# Altium project AC_controller.PrjPcb
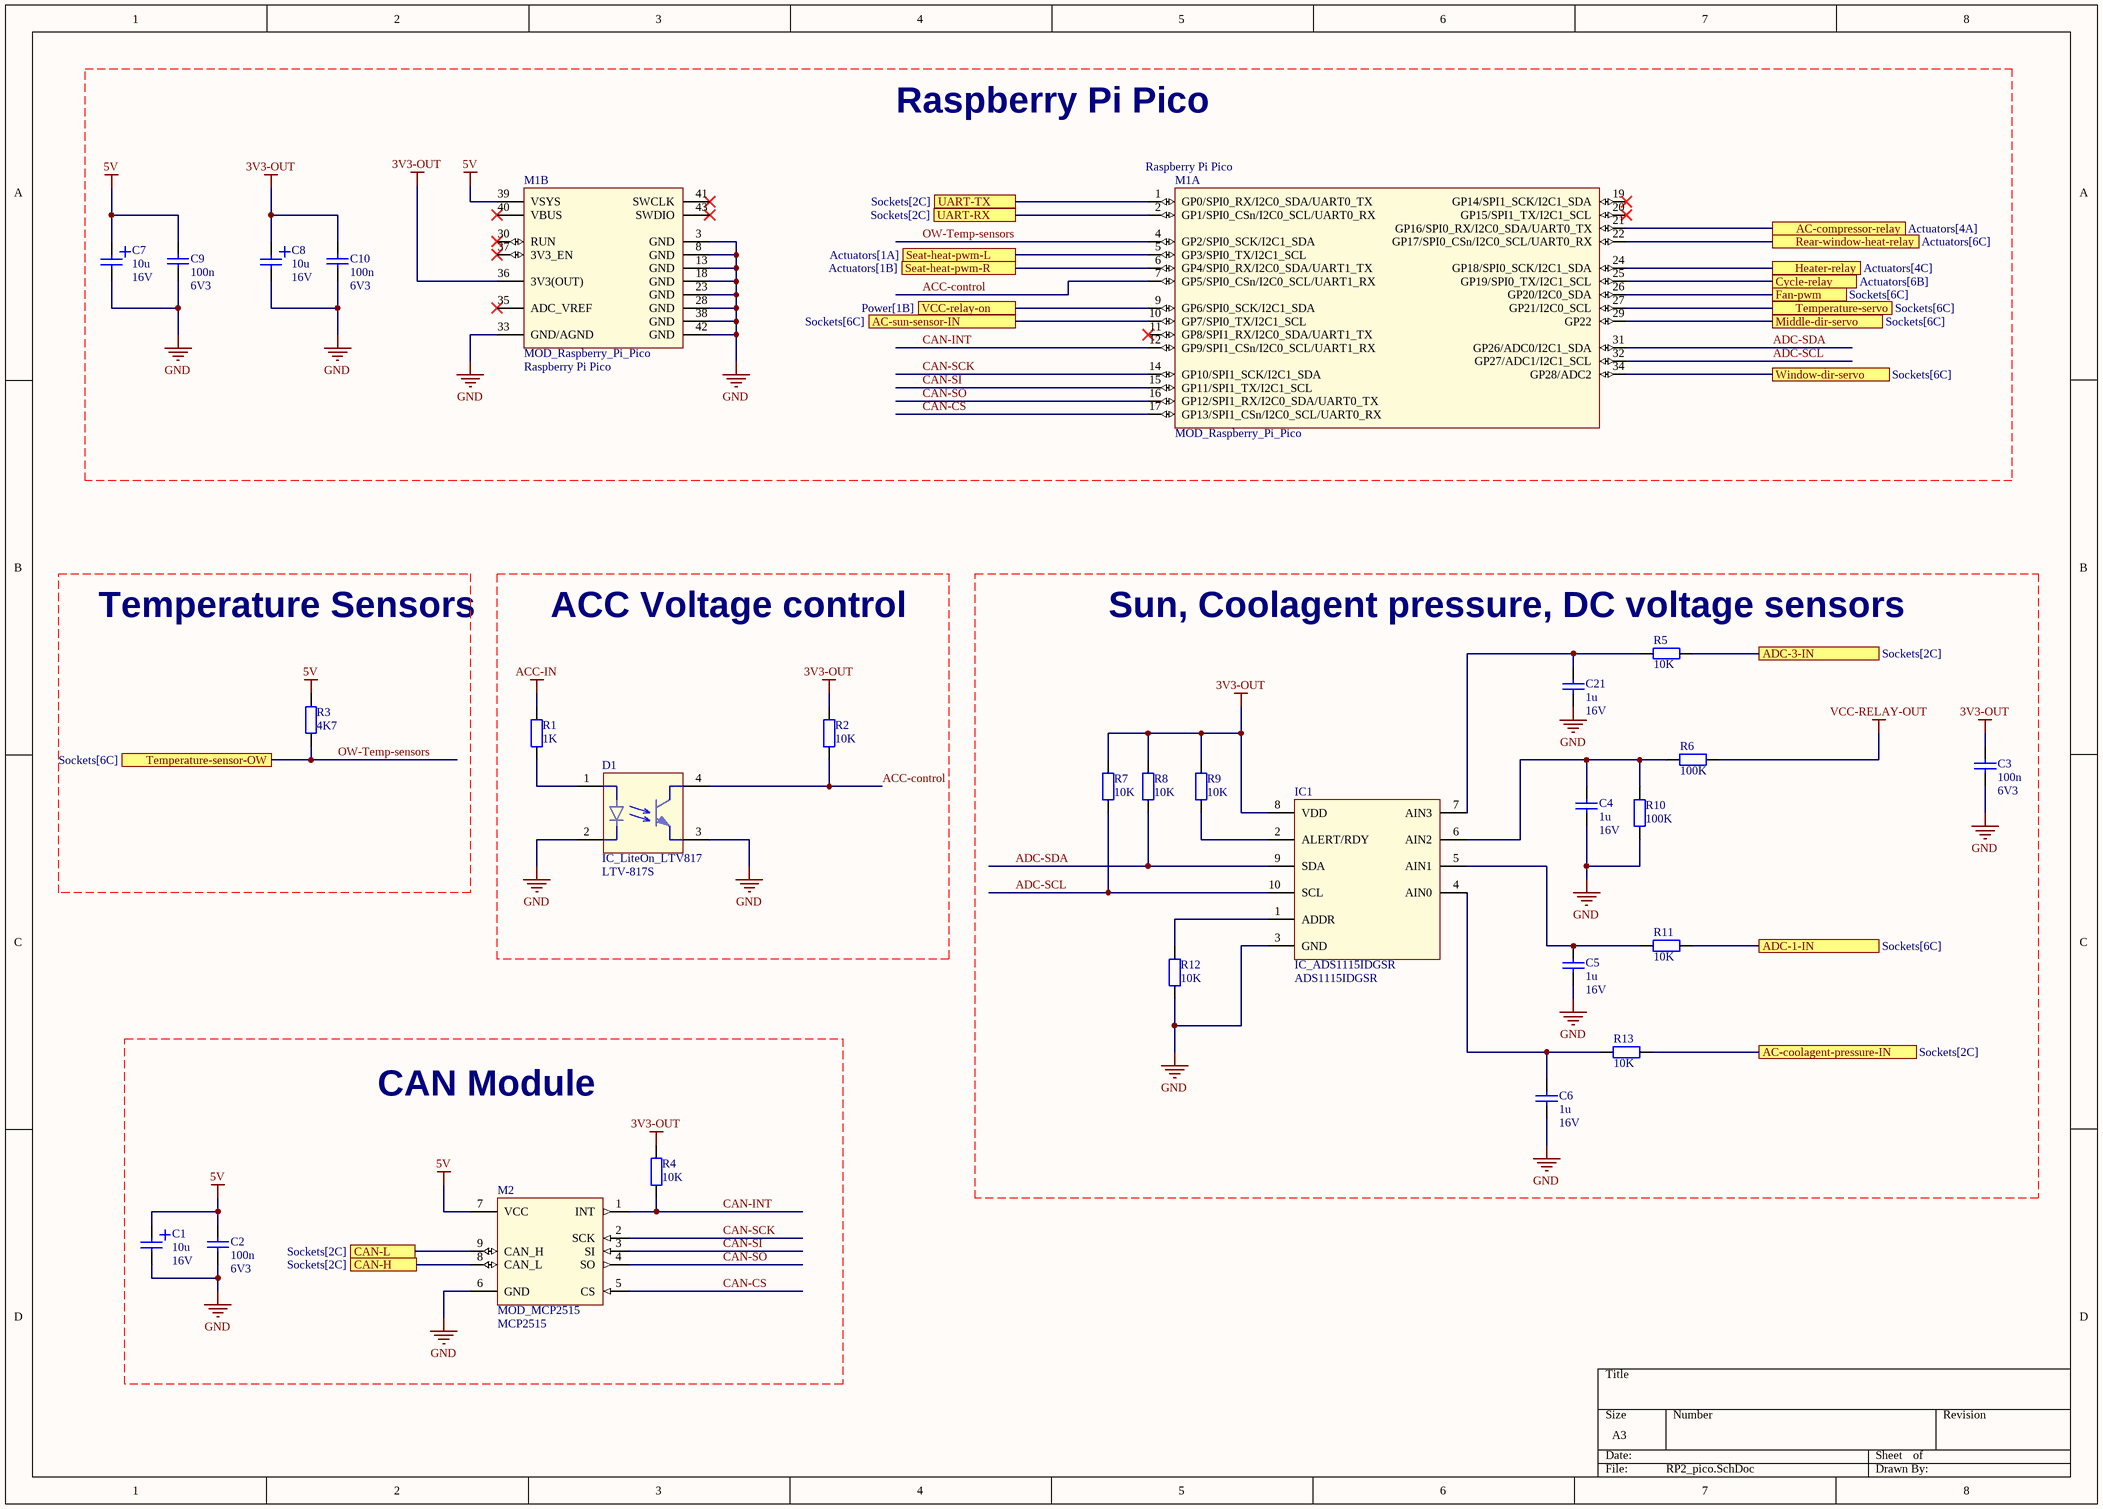
[diagram p0: RP2_pico.SchDoc]
4 sheets, 108 parts. Net scope: flat (ports and power ports of the same name join across sheets).
Board file: AC_controller_v1_1.PcbDoc
Sheets:
  RP2_pico.SchDoc
  Power.SchDoc
  Actuators.SchDoc
  Sockets.SchDoc

## Sheet RP2_pico.SchDoc
size A3; SheetNumber: 1; SheetTotal: 4

### Parts
C1  Value1: 10u  Value2: 16V  [CAPAE430X550N]  (hidden comment: CAP_POL)
C2  Value1: 100n  Value2: 6V3  [CAPC2012X88N]  (hidden comment: CAP)
C3  Value1: 100n  Value2: 6V3  [CAPC2012X88N]  (hidden comment: CAP)
C4  Value1: 1u  Value2: 16V  [CAPC2012X88N]  (hidden comment: CAP)
C5  Value1: 1u  Value2: 16V  [CAPC2012X88N]  (hidden comment: CAP)
C6  Value1: 1u  Value2: 16V  [CAPC2012X88N]  (hidden comment: CAP)
C7  Value1: 10u  Value2: 16V  [CAPAE430X550N]  (hidden comment: CAP_POL)
C8  Value1: 10u  Value2: 16V  [CAPAE430X550N]  (hidden comment: CAP_POL)
C9  Value1: 100n  Value2: 6V3  [CAPC2012X88N]  (hidden comment: CAP)
C10  Value1: 100n  Value2: 6V3  [CAPC2012X88N]  (hidden comment: CAP)
C21  Value1: 1u  Value2: 16V  [CAPC2012X88N]  (hidden comment: CAP)
D1  IC_LiteOn_LTV817  Value1: LTV-817S  [IC_LiteOn_ LTV-817S]
IC1  IC_ADS1115IDGSR  Value1: ADS1115IDGSR  [VSSOP-10]
M1  MOD_Raspberry_Pi_Pico  Value1: Raspberry Pi Pico  [MOD_Raspberry_Pi_Pico]  (parts A,B of 2)
M2  MOD_MCP2515  Value1: MCP2515  [MOD_MCP2515]
R1  Value1: 1K  [RESC2012X60N]  (hidden comment: RES)
R2  Value1: 10K  [RESC2012X60N]  (hidden comment: RES)
R3  Value1: 4K7  [RESC2012X60N]  (hidden comment: RES)
R4  Value1: 10K  [RESC2012X60N]  (hidden comment: RES)
R5  Value1: 10K  [RESC2012X60N]  (hidden comment: RES)
R6  Value1: 100K  [RESC2012X60N]  (hidden comment: RES)
R7  Value1: 10K  [RESC2012X60N]  (hidden comment: RES)
R8  Value1: 10K  [RESC2012X60N]  (hidden comment: RES)
R9  Value1: 10K  [RESC2012X60N]  (hidden comment: RES)
R10  Value1: 100K  [RESC2012X60N]  (hidden comment: RES)
R11  Value1: 10K  [RESC2012X60N]  (hidden comment: RES)
R12  Value1: 10K  [RESC2012X60N]  (hidden comment: RES)
R13  Value1: 10K  [RESC2012X60N]  (hidden comment: RES)

### Ports
AC-compressor-relay (see Actuators[4A]), AC-coolagent-pressure-IN (see Sockets[2C]), AC-sun-sensor-IN (see Sockets[6C]), ADC-1-IN (see Sockets[6C]), ADC-3-IN (see Sockets[2C]), CAN-H (see Sockets[2C]), CAN-L (see Sockets[2C]), Cycle-relay (see Actuators[6B]), Fan-pwm (see Sockets[6C]), Heater-relay (see Actuators[4C]), Middle-dir-servo (see Sockets[6C]), Rear-window-heat-relay (see Actuators[6C]), Seat-heat-pwm-L (see Actuators[1A]), Seat-heat-pwm-R (see Actuators[1B]), Temperature-sensor-OW (see Sockets[6C]), Temperature-servo (see Sockets[6C]), UART-RX (see Sockets[2C]), UART-TX (see Sockets[2C]), VCC-relay-on (see Power[1B]), Window-dir-servo (see Sockets[6C])

### Nets
3V3-OUT: C3.2 C8.1 C10.2 IC1.8(VDD) M1.36(3V3(OUT)) R2.2 R4.2 R7.2 R8.2 R9.2
5V: C1.1 C2.2 C7.1 C9.2 M1.39(VSYS) M2.7(VCC) R3.2
ACC-IN: R1.2
GND: C1.2 C2.1 C3.1 C4.1 C5.1 C6.1 C7.2 C8.2 C9.1 C10.1 C21.1 D1.2 D1.3 IC1.3(GND) M1.3(GND) M1.8(GND) M1.13(GND) M1.18(GND) M1.23(GND) M1.28(GND) M1.33(GND/AGND) M1.38(GND) M1.42(GND) M2.6(GND) R10.1 R12.1
VCC-RELAY-OUT: R6.2
ACC-control: D1.4 M1.7(GP5/SPI0_CSn/I2C0_SCL/UART1_RX) R2.1
ADC-SCL: IC1.10(SCL) M1.32(GP27/ADC1/I2C1_SCL) R7.1
ADC-SDA: IC1.9(SDA) M1.31(GP26/ADC0/I2C1_SDA) R8.1
CAN-CS: M1.17(GP13/SPI1_CSn/I2C0_SCL/UART0_RX) M2.5(CS)
CAN-INT: M1.12(GP9/SPI1_CSn/I2C0_SCL/UART1_RX) M2.1(INT) R4.1
CAN-SCK: M1.14(GP10/SPI1_SCK/I2C1_SDA) M2.2(SCK)
CAN-SI: M1.15(GP11/SPI1_TX/I2C1_SCL) M2.3(SI)
CAN-SO: M1.16(GP12/SPI1_RX/I2C0_SDA/UART0_TX) M2.4(SO)
OW-Temp-sensors: M1.4(GP2/SPI0_SCK/I2C1_SDA) R3.1 ; port Temperature-sensor-OW
NetC4_2: C4.2 IC1.6(AIN2) R6.1 R10.2
NetC5_2: C5.2 IC1.5(AIN1) R11.1
NetC6_2: C6.2 IC1.4(AIN0) R13.1
NetC21_2: C21.2 IC1.7(AIN3) R5.1
NetCN4_5: R13.2 ; port AC-coolagent-pressure-IN
NetCN4_6: R5.2 ; port ADC-3-IN
NetCN4_9: M2.8(CAN_L) ; port CAN-H
NetCN4_10: M2.9(CAN_H) ; port CAN-L
NetCN4_15: R11.2 ; port ADC-1-IN
NetD1_1: D1.1 R1.1
NetIC1_1: IC1.1(ADDR) R12.2
NetIC1_2: IC1.2(ALERT/RDY) R9.1
NetM1_1: M1.1(GP0/SPI0_RX/I2C0_SDA/UART0_TX) ; port UART-TX
NetM1_2: M1.2(GP1/SPI0_CSn/I2C0_SCL/UART0_RX) ; port UART-RX
NetM1_5: M1.5(GP3/SPI0_TX/I2C1_SCL) ; port Seat-heat-pwm-L
NetM1_6: M1.6(GP4/SPI0_RX/I2C0_SDA/UART1_TX) ; port Seat-heat-pwm-R
NetM1_9: M1.9(GP6/SPI0_SCK/I2C1_SDA) ; port VCC-relay-on
NetM1_10: M1.10(GP7/SPI0_TX/I2C1_SCL) ; port AC-sun-sensor-IN
NetM1_21: M1.21(GP16/SPI0_RX/I2C0_SDA/UART0_TX) ; port AC-compressor-relay
NetM1_22: M1.22(GP17/SPI0_CSn/I2C0_SCL/UART0_RX) ; port Rear-window-heat-relay
NetM1_24: M1.24(GP18/SPI0_SCK/I2C1_SDA) ; port Heater-relay
NetM1_25: M1.25(GP19/SPI0_TX/I2C1_SCL) ; port Cycle-relay
NetM1_26: M1.26(GP20/I2C0_SDA) ; port Fan-pwm
NetM1_27: M1.27(GP21/I2C0_SCL) ; port Temperature-servo
NetM1_29: M1.29(GP22) ; port Middle-dir-servo
NetM1_34: M1.34(GP28/ADC2) ; port Window-dir-servo

Not connected (* = marked no-connect by the designer): M1 11(GP8/SPI1_RX/I2C0_SDA/UART1_TX)* 19(GP14/SPI1_SCK/I2C1_SDA)* 20(GP15/SPI1_TX/I2C1_SCL)* 30(RUN)* 35(ADC_VREF)* 37(3V3_EN)* 40(VBUS)* 41(SWCLK)* 43(SWDIO)*

### Notes on the sheet
- Raspberry Pi Pico
- Temperature Sensors
- ACC Voltage control
- (near R5) Sun, Coolagent pressure, DC voltage sensors
- CAN Module

### Library data of the parts
C1 C7 C8 = 01_01399: ELCO 20%; Manufacturer: Nichicon; Manufacturer PN: UWF1C100MCL1GB; AutoId: 1399; DeviceType: capacitor; SubType: Electrolyte; Id: 01_01399; Status: 2 - Checked and Approved; MountType: SMT; ComponentLink1URL: X:\01_Datasheets\CAP_NICHICON_UWF1C100MCL1GB.pdf; Supplier 1: Farnell; Supplier Part Number 1: 647-UWF1C100MCL1GB; ComponentLink1Description: Datasheet
C2 C3 C9 C10 = 01_00637: X7R 10% 0805; Manufacturer: KEMET; Manufacturer PN: C0805C104K9RACTU; AutoId: 637; DeviceType: capacitor; SubType: Ceramic; Id: 01_00637; Status: 2 - Checked and Approved; MountType: SMT; ComponentLink1URL: X:\01_Datasheets\CAP_KEMET_CxxxxCxxxXxRAC.pdf; Supplier 1: Farnell; Supplier Part Number 1: 80-C0805C104K9R; ComponentLink1Description: Datasheet
C4-C6 C21 = 01_11496: Manufacturer: Hitano; Manufacturer PN: 0805B105K160N3; AutoId: 1562; Value3: X7R; DeviceType: capacitor; SubType: Ceramic; Id: 01_11496; Status: 0 - Unchecked; MountType: SMT; ComponentLink1URL: X:\01_Datasheets\; Supplier 1: Farnell; ComponentLink1Description: Datasheet
D1 = 07_00275: Transistor Output Optocouplers Optocoupler Phototrans; Manufacturer: Lite-On; AutoId: 276; Id: 07_00275; Value2: Optocouplers; Value3: Optocouplers; Manufacturer PN: LTV-817S; DeviceType: Optocouple; Status: 0 - Unchecked; MountType: SMT; ComponentLink1Description: Datasheet; ComponentLink1URL: X:\01_Datasheets\IC_Lite_On_LTV-817S.pdf; ComponentLink2Description: ComponentVerificationSheet; ComponentLink2URL: X:\02_ComponentVerificationSheets\; Supplier 1: Mouser; Supplier Part Number 1: 859-LTV-817S
IC1 = 07_00293: Analog to Digital Converters - ADC 16B ADC w/ Int MUX PGA Comp Osc & Ref; Manufacturer: Texas Instruments; AutoId: 300; Value2: 10 pin I2C ADC; DeviceType: IC; Id: 07_00293; Manufacturer PN: ADS1115IDGSR; Status: 0 - Unchecked; MountType: SMT; ComponentLink1Description: Datasheet; ComponentLink1URL: X:\01_Datasheets\ads1115.pdf; ComponentLink2Description: ComponentVerificationSheet; ComponentLink2URL: X:\02_ComponentVerificationSheets\
M1 = 12_00158: Single Board Computers Raspberry Pi Pico; Manufacturer PN: SC0915; AutoId: 169; Value2: RP2040; Value3: ARM Cortex M0; DeviceType: misc; Id: 12_00158; Manufacturer: Raspberry Pi; MountType: SMT; ComponentLink1Description: Datasheet; ComponentLink1URL: X:\01_Datasheets\Raspberry_Pi_Pico.pdf; ComponentLink2Description: ComponentVerificationSheet; ComponentLink2URL: X:\02_ComponentVerificationSheets\; Supplier 1: Mouser; Supplier Part Number 1: 358-SC0915
M2 = 12_00161: CAN bus  module; Manufacturer: CH; AutoId: 172; DeviceType: misc; Id: 12_00161; Value2: Module; Status: 0 - Unchecked; MountType: THD; ComponentLink1Description: Datasheet; ComponentLink1URL: X:\01_Datasheets\; ComponentLink2Description: ComponentVerificationSheet; ComponentLink2URL: X:\02_ComponentVerificationSheets\; Supplier 1: Arduino.ua
R1 = 15_00329: RESISTOR, 0805, 1K, 1%, SMD; Manufacturer: Yageo; Manufacturer PN: RC0805FR-071K; Id: 15_00341; AutoId: 329; Value2: 0W125; SubType: Metal film; DeviceType: resistor; Status: 2 - Checked and Approved; MountType: SMT; ComponentLink1Description: Datasheet; ComponentLink1URL: X:\01_Datasheets\RES_YAGEO_RC0805FR.pdf; Supplier 1: Farnell; Supplier Part Number 1: 9237496
R2 R4 R7-R9 R11-R13 = 15_00341: RESISTOR, 0805, 10K, 1%, SMD; Manufacturer: Yageo; Manufacturer PN: RC0805FR-0710K; AutoId: 341; Value2: 0W125; SubType: Metal film; Id: 15_00341; DeviceType: resistor; Status: 0 - Unchecked; MountType: SMT; ComponentLink1Description: Datasheet; ComponentLink1URL: X:\01_Datasheets\RES_YAGEO_RC0805FR.pdf; Supplier 1: Farnell
R3 = 15_00337: RESISTOR, 0805, 4K7, 1%, SMD; Manufacturer: Yageo; Manufacturer PN: RC0805FR-074K7; AutoId: 337; Value2: 0W125; SubType: Metal film; Id: 15_00337; DeviceType: resistor; Status: 2 - Checked and Approved; MountType: SMT; ComponentLink1Description: Datasheet; ComponentLink1URL: X:\01_Datasheets\RES_YAGEO_RC0805FR.pdf; Supplier 1: Farnell; Supplier Part Number 1: 9237704
R5 R6 R10 = 15_00353: RESISTOR, 0805, 100K, 1%, SMD; Manufacturer: Yageo; Manufacturer PN: RC0805FR-07100K; AutoId: 353; Value2: 0W125; SubType: Metal film; Id: 15_00353; DeviceType: resistor; Status: 0 - Unchecked; MountType: SMT; ComponentLink1Description: Datasheet; ComponentLink1URL: X:\01_Datasheets\RES_YAGEO_RC0805FR.pdf; Supplier 1: Farnell

## Sheet Power.SchDoc
size A3; SheetNumber: 2; SheetTotal: 4
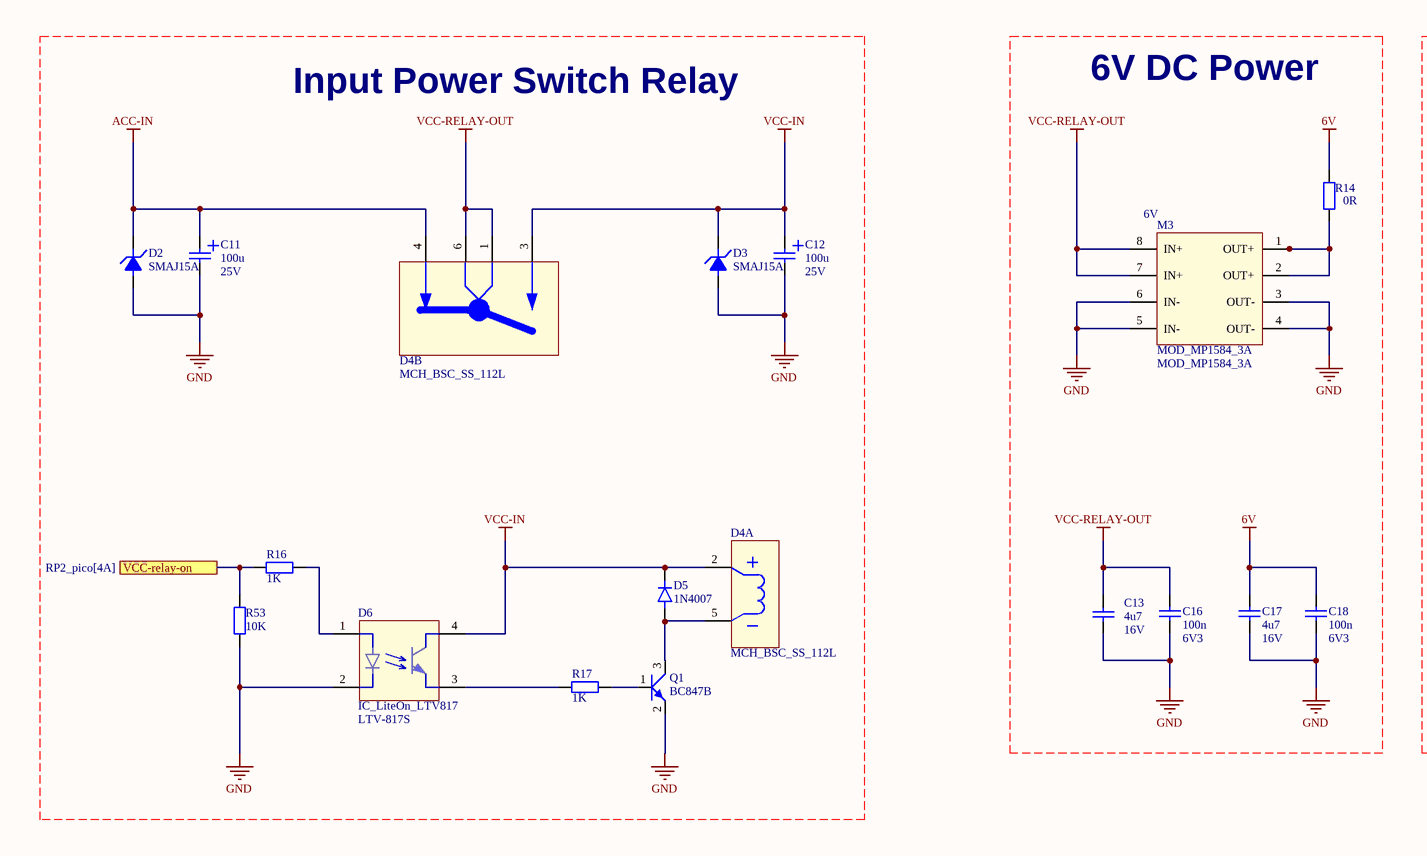
[diagram p1: Power.SchDoc, left]
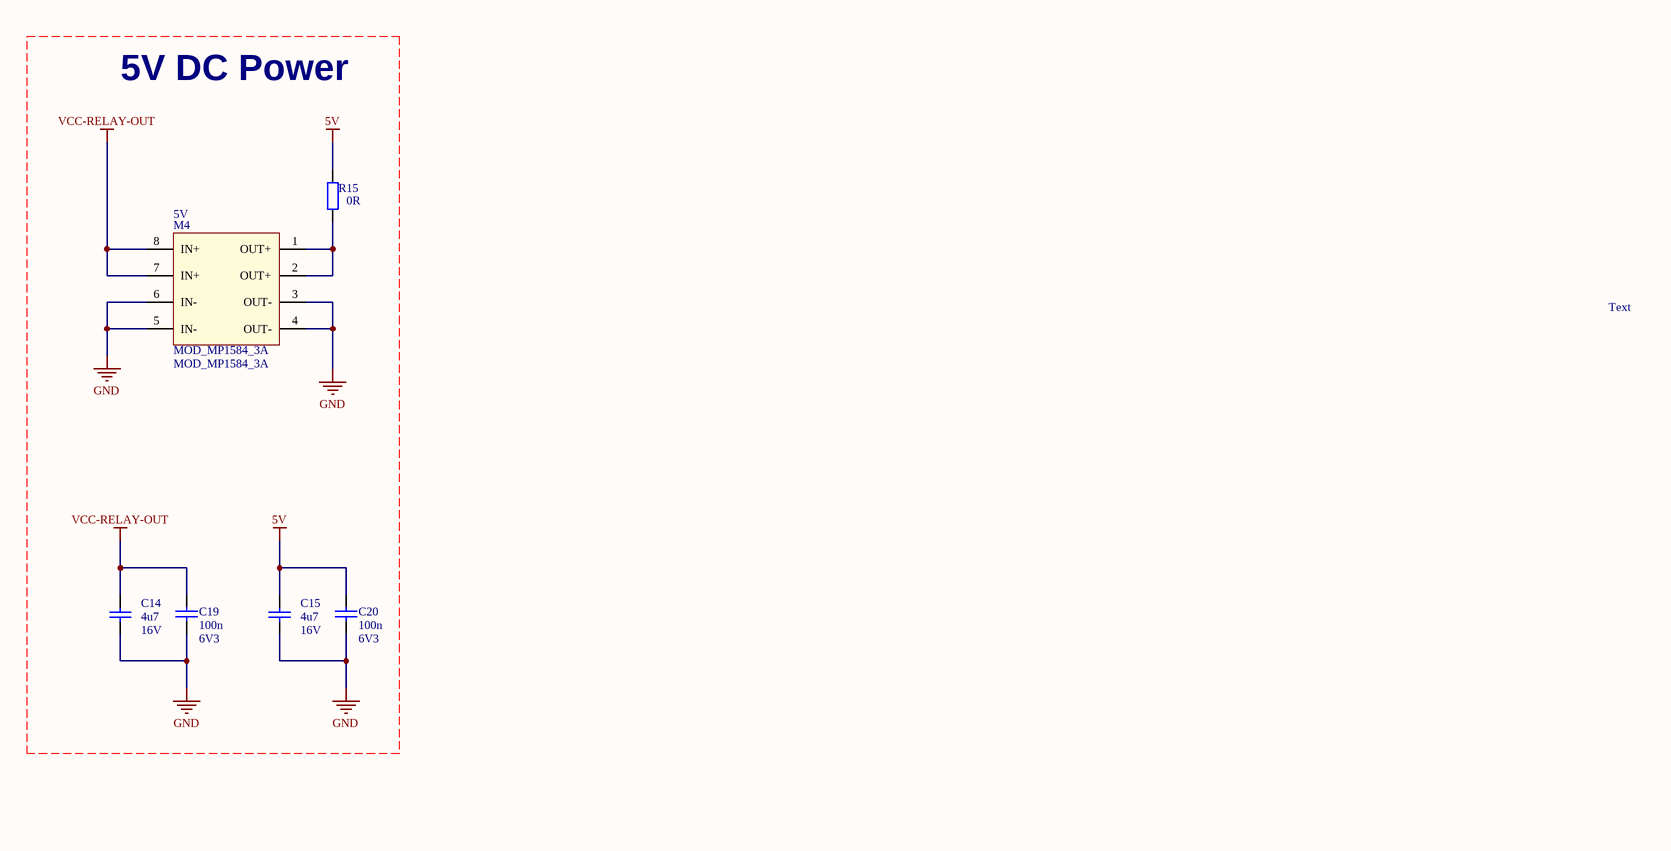
[diagram p2: Power.SchDoc, right]

### Parts
C11  Value1: 100u  Value2: 25V  [CAPAE9983X102N]  (hidden comment: CAP_POL)
C12  Value1: 100u  Value2: 25V  [CAPAE9983X102N]  (hidden comment: CAP_POL)
C13  Value1: 4u7  Value2: 16V  [CAPC2012X140N]  (hidden comment: CAP)
C14  Value1: 4u7  Value2: 16V  [CAPC2012X140N]  (hidden comment: CAP)
C15  Value1: 4u7  Value2: 16V  [CAPC2012X140N]  (hidden comment: CAP)
C16  Value1: 100n  Value2: 6V3  [CAPC2012X88N]  (hidden comment: CAP)
C17  Value1: 4u7  Value2: 16V  [CAPC2012X140N]  (hidden comment: CAP)
C18  Value1: 100n  Value2: 6V3  [CAPC2012X88N]  (hidden comment: CAP)
C19  Value1: 100n  Value2: 6V3  [CAPC2012X88N]  (hidden comment: CAP)
C20  Value1: 100n  Value2: 6V3  [CAPC2012X88N]  (hidden comment: CAP)
D2  Value1: SMAJ15A  [DO-214AC]  (hidden comment: DIO_UNIDIRECTIONAL_TVS)
D3  Value1: SMAJ15A  [DO-214AC]  (hidden comment: DIO_UNIDIRECTIONAL_TVS)
D4  MCH_BSC_SS_112L  [MCH_BSC_SS_112L]  (parts A,B of 2)
D5  Value1: 1N4007  [DO-214AC]  (hidden comment: DIO)
D6  IC_LiteOn_LTV817  Value1: LTV-817S  [IC_LiteOn_ LTV-817S]
M3  MOD_MP1584_3A  [MOD_MP1584_3A]
M4  MOD_MP1584_3A  [MOD_MP1584_3A]
Q1  Value1: BC847B  [SOT23]  (hidden comment: TRS_NPN_123)
R14  Value1: 0R  [RESC2012X60N]  (hidden comment: RES)
R15  Value1: 0R  [RESC2012X60N]  (hidden comment: RES)
R16  Value1: 1K  [RESC2012X60N]  (hidden comment: RES)
R17  Value1: 1K  [RESC2012X60N]  (hidden comment: RES)
R53  Value1: 10K  [RESC2012X60N]  (hidden comment: RES)

### Ports
VCC-relay-on (see RP2_pico[4A])

### Nets
5V: C15.1 C20.2 R15.2
6V: C17.2 C18.2 R14.2
ACC-IN: C11.1 D2.2 D4.4
GND: C11.2 C12.2 C13.2 C14.2 C15.2 C16.1 C17.1 C18.1 C19.1 C20.1 D2.1 D3.1 D6.2 M3.3(OUT-) M3.4(OUT-) M3.5(IN-) M3.6(IN-) M4.3(OUT-) M4.4(OUT-) M4.5(IN-) M4.6(IN-) Q1.2(E) R53.2
VCC-IN: C12.1 D3.2 D4.2 D4.3 D5.2(K) D6.4
VCC-RELAY-OUT: C13.1 C14.1 C16.2 C19.2 D4.1 D4.6 M3.7(IN+) M3.8(IN+) M4.7(IN+) M4.8(IN+)
NetD4_5: D4.5 D5.1(A) Q1.3(C)
NetD6_1: D6.1 R16.1
NetD6_3: D6.3 R17.2
NetM1_9: R16.2 R53.1 ; port VCC-relay-on
NetM3_1: M3.1(OUT+) M3.2(OUT+) R14.1
NetM4_1: M4.1(OUT+) M4.2(OUT+) R15.1
NetQ1_1: Q1.1(B) R17.1

### Notes on the sheet
- Input Power Switch Relay
- 6V DC Power
- 5V DC Power
- (near M3) 6V
- (near M4) 5V
- Text

### Library data of the parts
C11 C12 = 01_01471: PANASONIC - EEEFC1E101AP - CAP, ALU ELEC, 100UF, 25V, SMD, REEL; AutoId: 1471; DeviceType: capacitor; SubType: Electrolyte; Id: 01_01471; Manufacturer: Panasonic; Manufacturer PN: EEEFC1E101AP; Status: 0 - Unchecked; MountType: SMD; ComponentLink1URL: X:\01_dataSheets\CAP_PANASONIC_EEUFCXXXXXX.pdf; Supplier 1: Farnell; Supplier Part Number 1: 2254349; ComponentLink1Description: Datasheet
C13-C15 C17 = 01_01402: X7R 10% 0805; Manufacturer: MURATA; Manufacturer PN: GRM21BR71C475KA73L; AutoId: 1402; DeviceType: capacitor; SubType: Ceramic; Id: 01_01402; Status: 2 - Checked and Approved; MountType: SMD; ComponentLink1URL: X:\01_DataSheets\CAP_MURATA_GRM.pdf; Supplier 1: Farnell; Supplier Part Number 1: 1797015; ComponentLink1Description: Datasheet
C16 C18-C20 = 01_00637: as C2 on sheet RP2_pico; Id: 01_00637; Status: 2 - Checked and Approved; MountType: SMT; ComponentLink1URL: X:\01_Datasheets\CAP_KEMET_CxxxxCxxxXxRAC.pdf; Supplier 1: Farnell; Supplier Part Number 1: 80-C0805C104K9R; ComponentLink1Description: Datasheet
D2 D3 = 03_00100: Transient Voltage Suppressors; Manufacturer: Littelfuse; AutoId: 118; Value2: 15Vr 400W 16.4A; Value3: TVS; DeviceType: diode; Id: 03_00100; Manufacturer PN: SMAJ15A; Status: 0 - Unchecked; MountType: SMD; ComponentLink1Description: Datasheet; ComponentLink1URL: X:\01_Datasheets\DIO_Littelfuse_SMAJ58A.pdf; ComponentLink2Description: ComponentVerificationSheet; ComponentLink2URL: X:\02_ComponentVerificationSheets\; Supplier Part Number 1: SMAJ15A
D4 = 09_0010: Small relay 6 pins 12V, 2A; Manufacturer: KJS; AutoId: 10; Id: 09_0010; Value1: n/a; Value2: n/a; ComponentLink1Description: Datasheet; ComponentLink1URL: X:\01_Datasheets\MCH_BSC_SS_112L.pdf; ComponentLink2Description: ComponentVerificationSheet; ComponentLink2URL: X:\02_ComponentVerificationSheets\
D5 = 03_00099: M7 Diode, max 30A; AutoId: 117; Value2: 1A, 400V; Id: 03_00099; Value3: M7; Manufacturer PN: 1N4007; DeviceType: diode; ComponentLink1Description: Datasheet; ComponentLink1URL: X:\01_Datasheets\; ComponentLink2Description: ComponentVerificationSheet; ComponentLink2URL: X:\02_ComponentVerificationSheets\
D6 = 07_00275: as D1 on sheet RP2_pico; Id: 07_00275; Value2: Optocouplers; Value3: Optocouplers; Manufacturer PN: LTV-817S; DeviceType: Optocouple; Status: 0 - Unchecked; MountType: SMT; ComponentLink1Description: Datasheet; ComponentLink1URL: X:\01_Datasheets\IC_Lite_On_LTV-817S.pdf; ComponentLink2Description: ComponentVerificationSheet; ComponentLink2URL: X:\02_ComponentVerificationSheets\; Supplier 1: Mouser; Supplier Part Number 1: 859-LTV-817S
M3 M4 = 12_00162: DC-DC converter 3A; Manufacturer: CH; AutoId: 173; Value2: Module; DeviceType: misc; Id: 12_00162; Value1: MOD_MP1584_3A; Status: 0 - Unchecked; MountType: THD; ComponentLink1Description: Datasheet; ComponentLink1URL: X:\01_Datasheets\; ComponentLink2Description: ComponentVerificationSheet; ComponentLink2URL: X:\02_ComponentVerificationSheets\; Supplier 1: Arduino.ua
Q1 = 19_00039: Bipolar Transistors - BJT NPN 45V 100mA; Manufacturer: NXP; Manufacturer PN: BC847B,215; AutoId: 39; Value2: 45V 0,1A; Id: 19_00039; DeviceType: transistor; SubType: NPN; Status: 0 - Unchecked; MountType: SMD; ComponentLink1Description: Datasheet; ComponentLink1URL: X:\01_Datasheets\TRS_NXP_BC847.pdf; ComponentLink2Description: ComponentVerificationSheet; ComponentLink2URL: X:\02_ComponentVerificationSheets\; Supplier 1: Mouser; Supplier Part Number 1: 771-BC847B-T/R
R14 R15 = 15_00632: Thick Film Resistors - SMD ZERO OHM JUMPER 1/8watt; Manufacturer: Vishay; Manufacturer PN: RCG08050000Z0EA`; AutoId: 632; Value2: 125mW; Id: 15_00632; Footprint4: n/a; DeviceType: resistor; Status: 0 - Unchecked; MountType: SMT; ComponentLink1Description: Datasheet; ComponentLink1URL: X:\01_Datasheets\; Supplier 1: Mouser; Supplier Part Number 1: 71-RCG08050000Z0EA
R16 R17 = 15_00329: RESISTOR, 0805, 1K, 1%, SMD; Manufacturer: Yageo; Manufacturer PN: RC0805FR-071K; AutoId: 329; Value2: 0W125; SubType: Metal film; Id: 15_00329; DeviceType: resistor; Status: 2 - Checked and Approved; MountType: SMT; ComponentLink1Description: Datasheet; ComponentLink1URL: X:\01_Datasheets\RES_YAGEO_RC0805FR.pdf; Supplier 1: Farnell; Supplier Part Number 1: 9237496
R53 = 15_00341: as R2 on sheet RP2_pico; Id: 15_00341; DeviceType: resistor; Status: 0 - Unchecked; MountType: SMT; ComponentLink1Description: Datasheet; ComponentLink1URL: X:\01_Datasheets\RES_YAGEO_RC0805FR.pdf; Supplier 1: Farnell

## Sheet Actuators.SchDoc
size A2; SheetNumber: 3; SheetTotal: 4
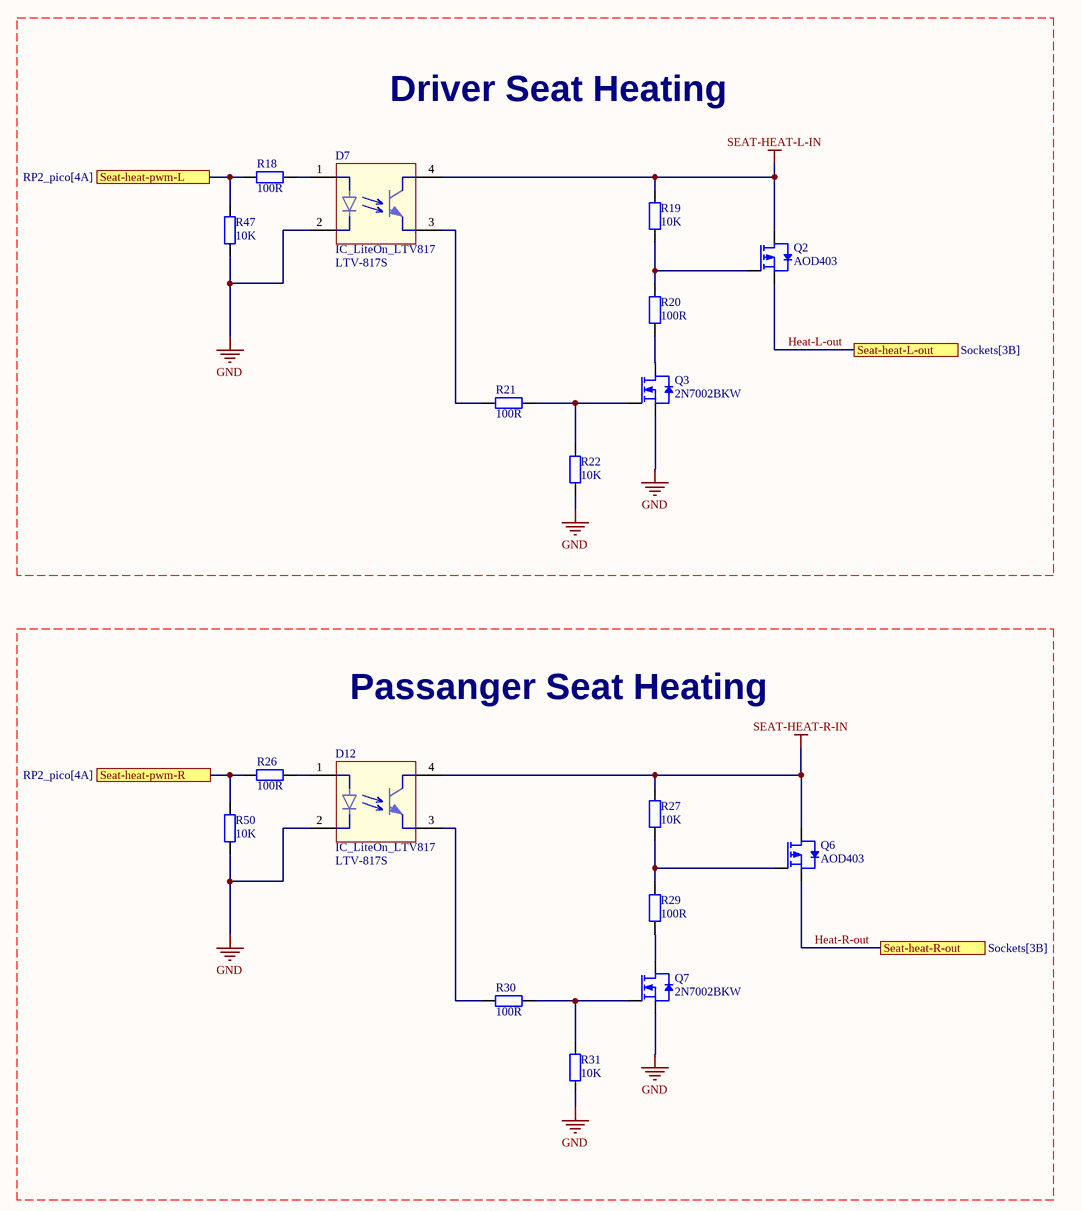
[diagram p3: Actuators.SchDoc, left]
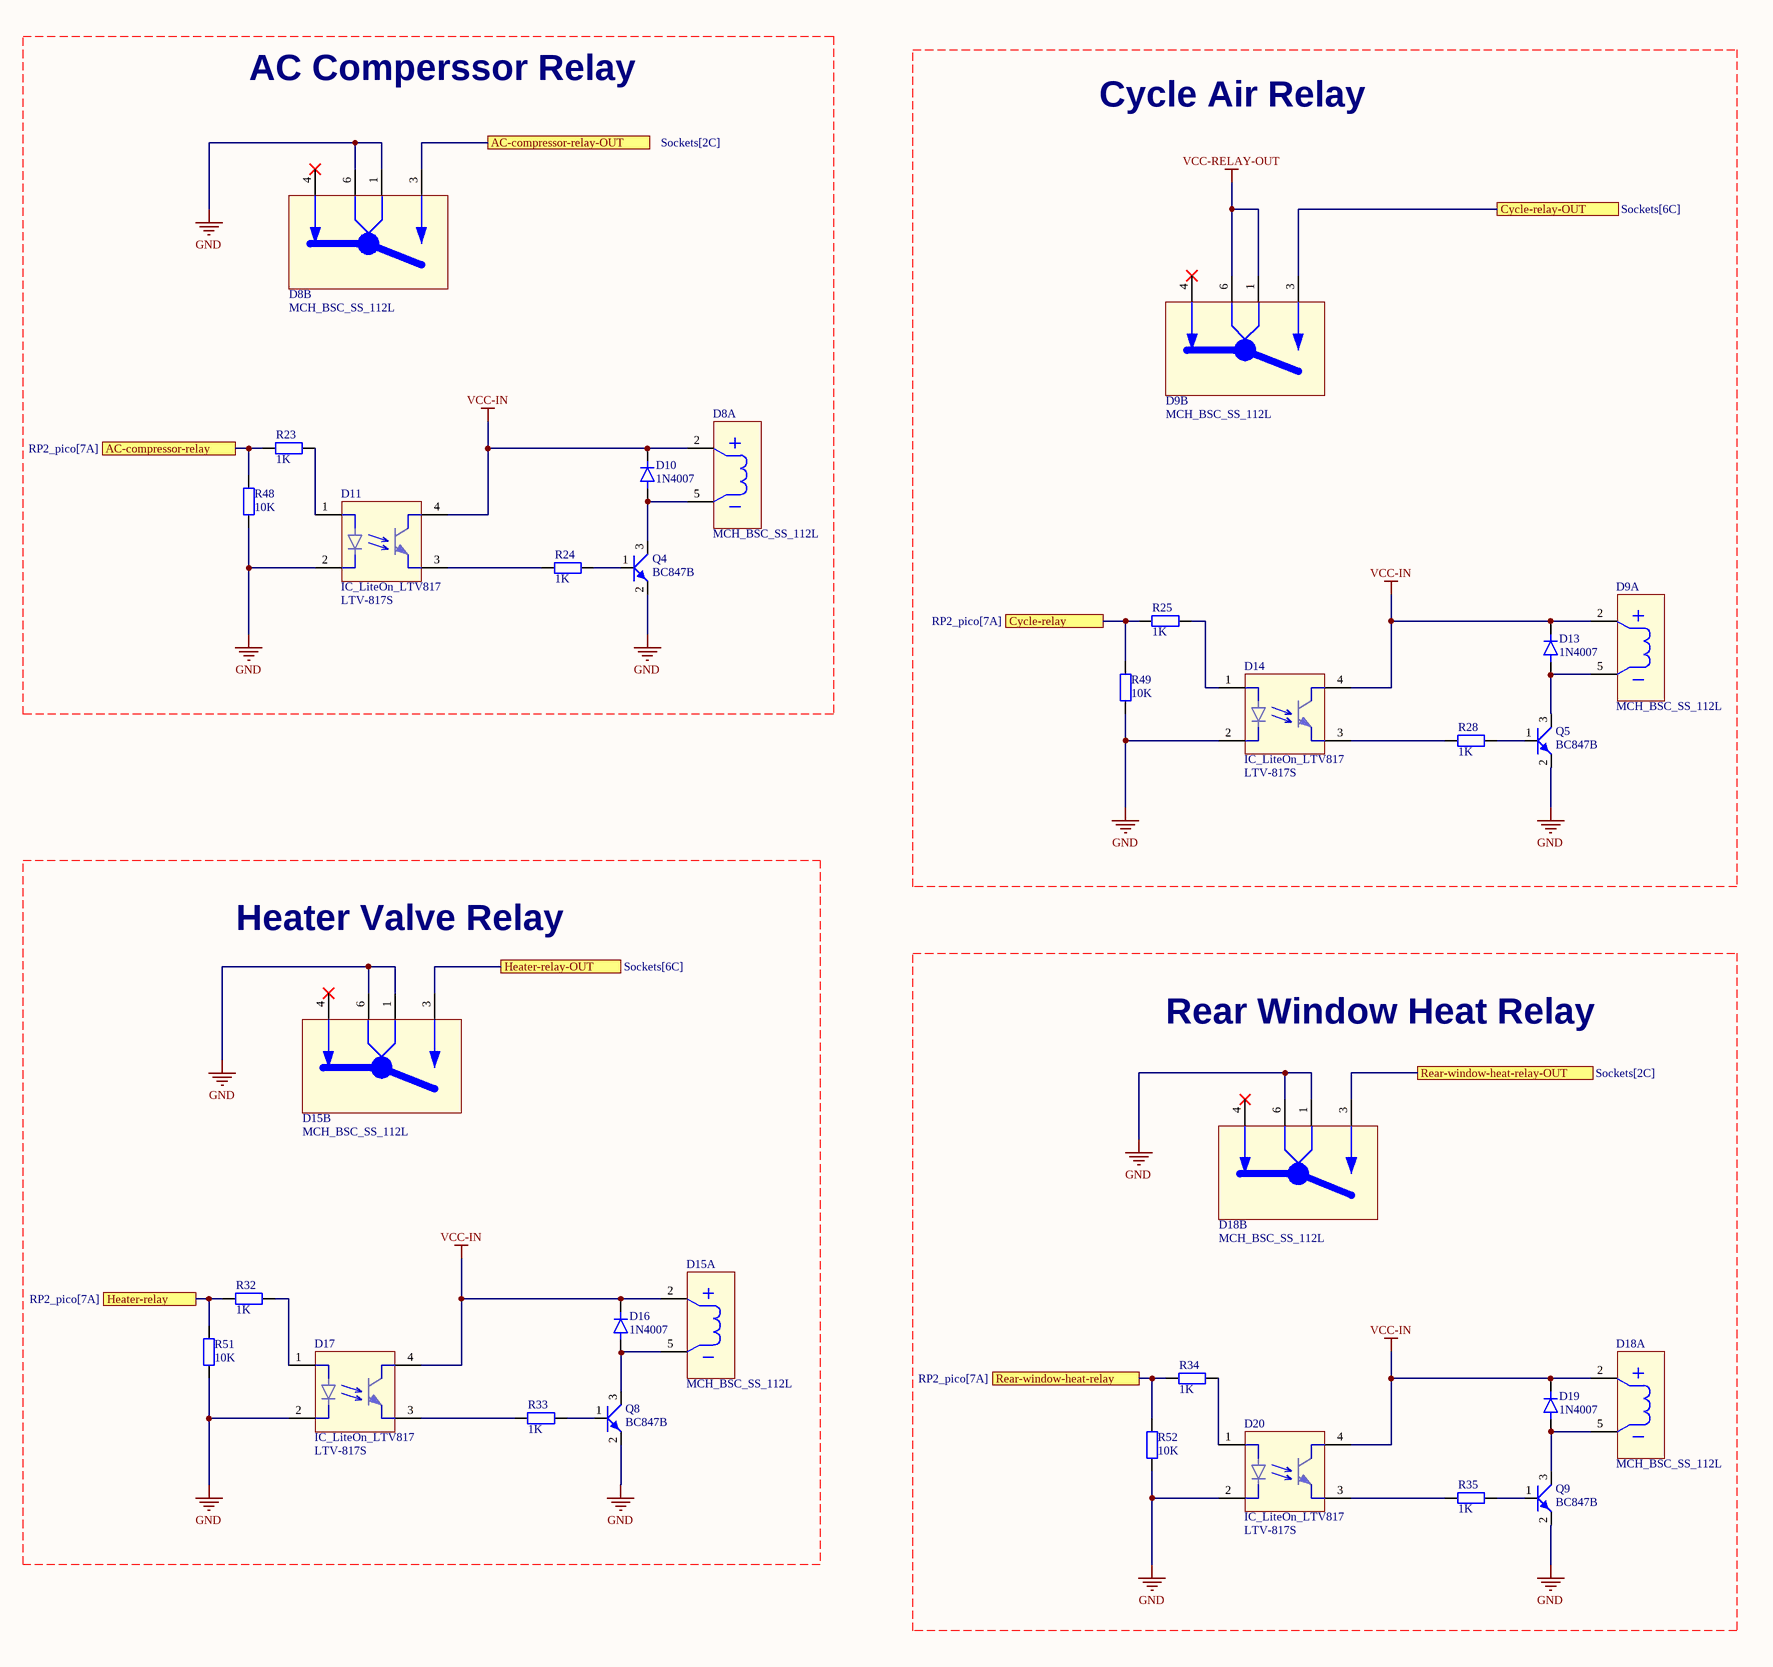
[diagram p4: Actuators.SchDoc, right]

### Parts
D7  IC_LiteOn_LTV817  Value1: LTV-817S  [IC_LiteOn_ LTV-817S]
D8  MCH_BSC_SS_112L  [MCH_BSC_SS_112L]  (parts A,B of 2)
D9  MCH_BSC_SS_112L  [MCH_BSC_SS_112L]  (parts A,B of 2)
D10  Value1: 1N4007  [DO-214AC]  (hidden comment: DIO)
D11  IC_LiteOn_LTV817  Value1: LTV-817S  [IC_LiteOn_ LTV-817S]
D12  IC_LiteOn_LTV817  Value1: LTV-817S  [IC_LiteOn_ LTV-817S]
D13  Value1: 1N4007  [DO-214AC]  (hidden comment: DIO)
D14  IC_LiteOn_LTV817  Value1: LTV-817S  [IC_LiteOn_ LTV-817S]
D15  MCH_BSC_SS_112L  [MCH_BSC_SS_112L]  (parts A,B of 2)
D16  Value1: 1N4007  [DO-214AC]  (hidden comment: DIO)
D17  IC_LiteOn_LTV817  Value1: LTV-817S  [IC_LiteOn_ LTV-817S]
D18  MCH_BSC_SS_112L  [MCH_BSC_SS_112L]  (parts A,B of 2)
D19  Value1: 1N4007  [DO-214AC]  (hidden comment: DIO)
D20  IC_LiteOn_LTV817  Value1: LTV-817S  [IC_LiteOn_ LTV-817S]
Q2  Value1: AOD403  [TO-252]  (hidden comment: TRS_FETP_123)
Q3  Value1: 2N7002BKW  [SOT65P210X110-3N]  (hidden comment: TRS_FETN_123)
Q4  Value1: BC847B  [SOT23]  (hidden comment: TRS_NPN_123)
Q5  Value1: BC847B  [SOT23]  (hidden comment: TRS_NPN_123)
Q6  Value1: AOD403  [TO-252]  (hidden comment: TRS_FETP_123)
Q7  Value1: 2N7002BKW  [SOT65P210X110-3N]  (hidden comment: TRS_FETN_123)
Q8  Value1: BC847B  [SOT23]  (hidden comment: TRS_NPN_123)
Q9  Value1: BC847B  [SOT23]  (hidden comment: TRS_NPN_123)
R18  Value1: 100R  [RESC2012X60N]  (hidden comment: RES)
R19  Value1: 10K  [RESC2012X60N]  (hidden comment: RES)
R20  Value1: 100R  [RESC2012X60N]  (hidden comment: RES)
R21  Value1: 100R  [RESC2012X60N]  (hidden comment: RES)
R22  Value1: 10K  [RESC2012X60N]  (hidden comment: RES)
R23  Value1: 1K  [RESC2012X60N]  (hidden comment: RES)
R24  Value1: 1K  [RESC2012X60N]  (hidden comment: RES)
R25  Value1: 1K  [RESC2012X60N]  (hidden comment: RES)
R26  Value1: 100R  [RESC2012X60N]  (hidden comment: RES)
R27  Value1: 10K  [RESC2012X60N]  (hidden comment: RES)
R28  Value1: 1K  [RESC2012X60N]  (hidden comment: RES)
R29  Value1: 100R  [RESC2012X60N]  (hidden comment: RES)
R30  Value1: 100R  [RESC2012X60N]  (hidden comment: RES)
R31  Value1: 10K  [RESC2012X60N]  (hidden comment: RES)
R32  Value1: 1K  [RESC2012X60N]  (hidden comment: RES)
R33  Value1: 1K  [RESC2012X60N]  (hidden comment: RES)
R34  Value1: 1K  [RESC2012X60N]  (hidden comment: RES)
R35  Value1: 1K  [RESC2012X60N]  (hidden comment: RES)
R47  Value1: 10K  [RESC2012X60N]  (hidden comment: RES)
R48  Value1: 10K  [RESC2012X60N]  (hidden comment: RES)
R49  Value1: 10K  [RESC2012X60N]  (hidden comment: RES)
R50  Value1: 10K  [RESC2012X60N]  (hidden comment: RES)
R51  Value1: 10K  [RESC2012X60N]  (hidden comment: RES)
R52  Value1: 10K  [RESC2012X60N]  (hidden comment: RES)

### Ports
AC-compressor-relay (see RP2_pico[7A]), AC-compressor-relay-OUT (see Sockets[2C]), Cycle-relay (see RP2_pico[7A]), Cycle-relay-OUT (see Sockets[6C]), Heater-relay (see RP2_pico[7A]), Heater-relay-OUT (see Sockets[6C]), Rear-window-heat-relay (see RP2_pico[7A]), Rear-window-heat-relay-OUT (see Sockets[2C]), Seat-heat-L-out (see Sockets[3B]), Seat-heat-pwm-L (see RP2_pico[4A]), Seat-heat-pwm-R (see RP2_pico[4A]), Seat-heat-R-out (see Sockets[3B])

### Nets
GND: D7.2 D8.1 D8.6 D11.2 D12.2 D14.2 D15.1 D15.6 D17.2 D18.1 D18.6 D20.2 Q3.2(S) Q4.2(E) Q5.2(E) Q7.2(S) Q8.2(E) Q9.2(E) R22.1 R31.1 R47.2 R48.2 R49.2 R50.2 R51.2 R52.2
SEAT-HEAT-L-IN: D7.4 Q2.3(D) R19.1
SEAT-HEAT-R-IN: D12.4 Q6.3(D) R27.1
VCC-IN: D8.2 D9.2 D10.2(K) D11.4 D13.2(K) D14.4 D15.2 D16.2(K) D17.4 D18.2 D19.2(K) D20.4
VCC-RELAY-OUT: D9.1 D9.6
Heat-L-out: Q2.2(S) ; port Seat-heat-L-out
Heat-R-out: Q6.2(S) ; port Seat-heat-R-out
NetCN4_2: D8.3 ; port AC-compressor-relay-OUT
NetCN4_3: D18.3 ; port Rear-window-heat-relay-OUT
NetCN4_13: D9.3 ; port Cycle-relay-OUT
NetCN4_20: D15.3 ; port Heater-relay-OUT
NetD7_1: D7.1 R18.2
NetD7_3: D7.3 R21.1
NetD8_5: D8.5 D10.1(A) Q4.3(C)
NetD9_5: D9.5 D13.1(A) Q5.3(C)
NetD11_1: D11.1 R23.1
NetD11_3: D11.3 R24.2
NetD12_1: D12.1 R26.2
NetD12_3: D12.3 R30.2
NetD14_1: D14.1 R25.1
NetD14_3: D14.3 R28.2
NetD15_5: D15.5 D16.1(A) Q8.3(C)
NetD17_1: D17.1 R32.1
NetD17_3: D17.3 R33.2
NetD18_5: D18.5 D19.1(A) Q9.3(C)
NetD20_1: D20.1 R34.1
NetD20_3: D20.3 R35.2
NetM1_5: R18.1 R47.1 ; port Seat-heat-pwm-L
NetM1_6: R26.1 R50.1 ; port Seat-heat-pwm-R
NetM1_21: R23.2 R48.1 ; port AC-compressor-relay
NetM1_22: R34.2 R52.1 ; port Rear-window-heat-relay
NetM1_24: R32.2 R51.1 ; port Heater-relay
NetM1_25: R25.2 R49.1 ; port Cycle-relay
NetQ2_1: Q2.1(G) R19.2 R20.2
NetQ3_1: Q3.1(G) R21.2 R22.2
NetQ3_3: Q3.3(D) R20.1
NetQ4_1: Q4.1(B) R24.1
NetQ5_1: Q5.1(B) R28.1
NetQ6_1: Q6.1(G) R27.2 R29.2
NetQ7_1: Q7.1(G) R30.1 R31.2
NetQ7_3: Q7.3(D) R29.1
NetQ8_1: Q8.1(B) R33.1
NetQ9_1: Q9.1(B) R35.1

Not connected (* = marked no-connect by the designer): D8 4*; D9 4*; D15 4*; D18 4*

### Notes on the sheet
- AC Comperssor Relay
- Cycle Air Relay
- Driver Seat Heating
- Passanger Seat Heating
- Heater Valve Relay
- Rear Window Heat Relay

### Library data of the parts
D7 D11 D12 D14 D17 D20 = 07_00275: as D1 on sheet RP2_pico; Id: 07_00275; Value2: Optocouplers; Value3: Optocouplers; Manufacturer PN: LTV-817S; DeviceType: Optocouple; Status: 0 - Unchecked; MountType: SMT; ComponentLink1Description: Datasheet; ComponentLink1URL: X:\01_Datasheets\IC_Lite_On_LTV-817S.pdf; ComponentLink2Description: ComponentVerificationSheet; ComponentLink2URL: X:\02_ComponentVerificationSheets\; Supplier 1: Mouser; Supplier Part Number 1: 859-LTV-817S
D8 D9 D15 D18 = 09_0010: as D4 on sheet Power; Id: 09_0010; Value1: n/a; Value2: n/a; ComponentLink1Description: Datasheet; ComponentLink1URL: X:\01_Datasheets\MCH_BSC_SS_112L.pdf; ComponentLink2Description: ComponentVerificationSheet; ComponentLink2URL: X:\02_ComponentVerificationSheets\
D10 D13 D16 D19 = 03_00099: as D5 on sheet Power; Id: 03_00099; Value3: M7; Manufacturer PN: 1N4007; DeviceType: diode; ComponentLink1Description: Datasheet; ComponentLink1URL: X:\01_Datasheets\; ComponentLink2Description: ComponentVerificationSheet; ComponentLink2URL: X:\02_ComponentVerificationSheets\
Q2 Q6 = 19_00048: 30V P-Channel MOSFET; Manufacturer: Alpha & Omega; AutoId: 54; Value2: 30V, 70A; DeviceType: transistor; SubType: P MOSFET; Id: 19_00048; Manufacturer PN: AOD403; Status: 0 - Unchecked; MountType: SMT; ComponentLink1Description: Datasheet; ComponentLink1URL: X:\01_Datasheets\AOD403.pdf; ComponentLink2Description: ComponentVerificationSheet; ComponentLink2URL: X:\02_ComponentVerificationSheets\
Q3 Q7 = 19_00024: NXP - 2N7002BKW - MOSFET, N CH, 60V, 0.31A, SOT323; AutoId: 24; DeviceType: transistor; Id: 19_00024; Value2: n/a; Manufacturer: NXP; Manufacturer PN: 2N7002BKW; SubType: MOSFET; Status: 2 - Checked and Approved; MountType: SMD; ComponentLink1Description: Datasheet; ComponentLink1URL: X:\01_dataSheets\TRS_NXP_2N7002BKW.pdf; ComponentLink2Description: ComponentVerificationSheet; ComponentLink2URL: X:\02_ComponentVerificationSheets\; Supplier 1: Farnell; Supplier Part Number 1: 1894713RL
Q4 Q5 Q8 Q9 = 19_00039: as Q1 on sheet Power; Id: 19_00039; DeviceType: transistor; SubType: NPN; Status: 0 - Unchecked; MountType: SMD; ComponentLink1Description: Datasheet; ComponentLink1URL: X:\01_Datasheets\TRS_NXP_BC847.pdf; ComponentLink2Description: ComponentVerificationSheet; ComponentLink2URL: X:\02_ComponentVerificationSheets\; Supplier 1: Mouser; Supplier Part Number 1: 771-BC847B-T/R
R18 R20 R21 R26 R29 R30 = 15_00317: RESISTOR, 0805, 100R, 1%, SMD; Manufacturer: Yageo; Manufacturer PN: RC0805FR-07100R; AutoId: 317; Value2: 0W125; SubType: Metal film; Id: 15_00317; DeviceType: resistor; Status: 2 - Checked and Approved; MountType: SMT; ComponentLink1Description: Datasheet; ComponentLink1URL: X:\01_Datasheets\RES_YAGEO_RC0805FR.pdf; Supplier 1: Farnell; Supplier Part Number 1: 9237364
R19 R22 R27 R31 R47-R52 = 15_00341: as R2 on sheet RP2_pico; Id: 15_00341; DeviceType: resistor; Status: 0 - Unchecked; MountType: SMT; ComponentLink1Description: Datasheet; ComponentLink1URL: X:\01_Datasheets\RES_YAGEO_RC0805FR.pdf; Supplier 1: Farnell
R23-R25 R28 R32-R35 = 15_00329: as R16 on sheet Power; Id: 15_00329; DeviceType: resistor; Status: 2 - Checked and Approved; MountType: SMT; ComponentLink1Description: Datasheet; ComponentLink1URL: X:\01_Datasheets\RES_YAGEO_RC0805FR.pdf; Supplier 1: Farnell; Supplier Part Number 1: 9237496

## Sheet Sockets.SchDoc
size A3; SheetNumber: 4; SheetTotal: 4
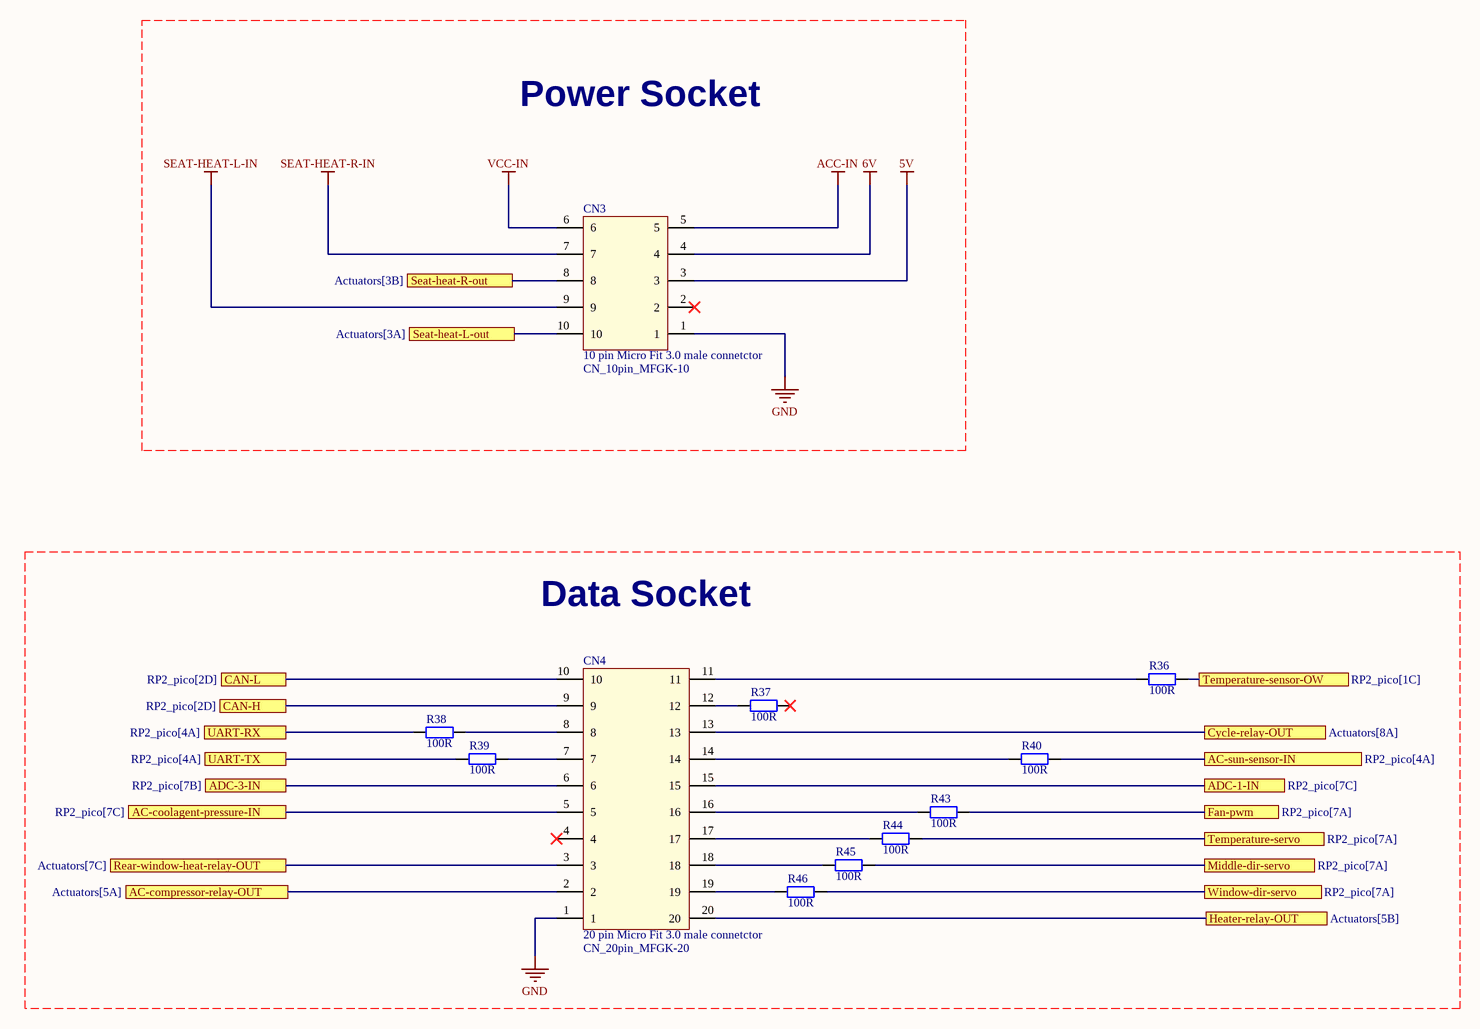
[diagram p5: Sockets.SchDoc]

### Parts
CN3  10 pin Micro Fit 3.0 male connetctor  [CN_10pin_MFGK-10]
CN4  20 pin Micro Fit 3.0 male connetctor  [CN_20pin_MFGK-20]
R36  Value1: 100R  [RESC2012X60N]  (hidden comment: RES)
R37  Value1: 100R  [RESC2012X60N]  (hidden comment: RES)
R38  Value1: 100R  [RESC2012X60N]  (hidden comment: RES)
R39  Value1: 100R  [RESC2012X60N]  (hidden comment: RES)
R40  Value1: 100R  [RESC2012X60N]  (hidden comment: RES)
R43  Value1: 100R  [RESC2012X60N]  (hidden comment: RES)
R44  Value1: 100R  [RESC2012X60N]  (hidden comment: RES)
R45  Value1: 100R  [RESC2012X60N]  (hidden comment: RES)
R46  Value1: 100R  [RESC2012X60N]  (hidden comment: RES)

### Ports
AC-compressor-relay-OUT (see Actuators[5A]), AC-coolagent-pressure-IN (see RP2_pico[7C]), AC-sun-sensor-IN (see RP2_pico[4A]), ADC-1-IN (see RP2_pico[7C]), ADC-3-IN (see RP2_pico[7B]), CAN-H (see RP2_pico[2D]), CAN-L (see RP2_pico[2D]), Cycle-relay-OUT (see Actuators[8A]), Fan-pwm (see RP2_pico[7A]), Heater-relay-OUT (see Actuators[5B]), Middle-dir-servo (see RP2_pico[7A]), Rear-window-heat-relay-OUT (see Actuators[7C]), Seat-heat-L-out (see Actuators[3A]), Seat-heat-R-out (see Actuators[3B]), Temperature-sensor-OW (see RP2_pico[1C]), Temperature-servo (see RP2_pico[7A]), UART-RX (see RP2_pico[4A]), UART-TX (see RP2_pico[4A]), Window-dir-servo (see RP2_pico[7A])

### Nets
5V: CN3.3
6V: CN3.4
ACC-IN: CN3.5
GND: CN3.1 CN4.1
SEAT-HEAT-L-IN: CN3.9
SEAT-HEAT-R-IN: CN3.7
VCC-IN: CN3.6
Heat-L-out: CN3.10 ; port Seat-heat-L-out
Heat-R-out: CN3.8 ; port Seat-heat-R-out
OW-Temp-sensors: R36.2 ; port Temperature-sensor-OW
NetCN4_2: CN4.2 ; port AC-compressor-relay-OUT
NetCN4_3: CN4.3 ; port Rear-window-heat-relay-OUT
NetCN4_5: CN4.5 ; port AC-coolagent-pressure-IN
NetCN4_6: CN4.6 ; port ADC-3-IN
NetCN4_7: CN4.7 R39.1
NetCN4_8: CN4.8 R38.1
NetCN4_9: CN4.9 ; port CAN-H
NetCN4_10: CN4.10 ; port CAN-L
NetCN4_11: CN4.11 R36.1
NetCN4_12: CN4.12 R37.1
NetCN4_13: CN4.13 ; port Cycle-relay-OUT
NetCN4_14: CN4.14 R40.1
NetCN4_15: CN4.15 ; port ADC-1-IN
NetCN4_16: CN4.16 R43.1
NetCN4_17: CN4.17 R44.1
NetCN4_18: CN4.18 R45.1
NetCN4_19: CN4.19 R46.1
NetCN4_20: CN4.20 ; port Heater-relay-OUT
NetM1_1: R39.2 ; port UART-TX
NetM1_2: R38.2 ; port UART-RX
NetM1_10: R40.2 ; port AC-sun-sensor-IN
NetM1_26: R43.2 ; port Fan-pwm
NetM1_27: R44.2 ; port Temperature-servo
NetM1_29: R45.2 ; port Middle-dir-servo
NetM1_34: R46.2 ; port Window-dir-servo

Not connected (* = marked no-connect by the designer): CN3 2*; CN4 4*; R37 2*

### Notes on the sheet
- Power Socket
- Data Socket

### Library data of the parts
CN3 = 02_10137: Molex, Micro-Fit 3.0, 43045, 10 Way, 2 Row, Right Angle PCB Header; Manufacturer PN: 43045-1000; AutoId: 179; Value2: 10 pin; Value3: 3.0 mm; DeviceType: Connector_; Id: 02_10137; Value1: CN_10pin_MFGK-10; Manufacturer: Molex; MountType: SMT; ComponentLink1Description: Datasheet; ComponentLink1URL: X:\01_Datasheets\CN_molex_micro_fit_430045.pdf; ComponentLink2Description: ComponentVerificationSheet; ComponentLink2URL: X:\02_ComponentVerificationSheets\; Supplier 1: kosmodrom.ua; Supplier Part Number 1: 00-00041120
CN4 = 02_10136: Molex, Micro-Fit 3.0, 43045, 20 Way, 2 Row, Right Angle PCB Header; Manufacturer PN: 43045-2000; AutoId: 177; Value2: 20 pin; Value3: 3.0 mm; DeviceType: Connector_; Id: 02_10136; Value1: CN_20pin_MFGK-20; Manufacturer: Molex; MountType: SMT; ComponentLink1Description: Datasheet; ComponentLink1URL: X:\01_Datasheets\CN_molex_micro_fit_430045.pdf; ComponentLink2Description: ComponentVerificationSheet; ComponentLink2URL: X:\02_ComponentVerificationSheets\; Supplier 1: kosmodrom.ua; Supplier Part Number 1: 00-00041123
R36-R40 R43-R46 = 15_00317: as R18 on sheet Actuators; Id: 15_00317; DeviceType: resistor; Status: 2 - Checked and Approved; MountType: SMT; ComponentLink1Description: Datasheet; ComponentLink1URL: X:\01_Datasheets\RES_YAGEO_RC0805FR.pdf; Supplier 1: Farnell; Supplier Part Number 1: 9237364

## Nets that join several sheets
5V: RP2_pico (7 pins), Power (C15.1 C20.2 R15.2), Sockets (CN3.3)
6V: Power (C17.2 C18.2 R14.2), Sockets (CN3.4)
ACC-IN: RP2_pico (R1.2), Power (C11.1 D2.2 D4.4), Sockets (CN3.5)
GND: RP2_pico (26 pins), Power (23 pins), Actuators (26 pins), Sockets (CN3.1 CN4.1)
SEAT-HEAT-L-IN: Actuators (D7.4 Q2.3 R19.1), Sockets (CN3.9)
SEAT-HEAT-R-IN: Actuators (D12.4 Q6.3 R27.1), Sockets (CN3.7)
VCC-IN: Power (6 pins), Actuators (12 pins), Sockets (CN3.6)
VCC-RELAY-OUT: RP2_pico (R6.2), Power (10 pins), Actuators (D9.1 D9.6)
Heat-L-out: Actuators (Q2.2), Sockets (CN3.10)
Heat-R-out: Actuators (Q6.2), Sockets (CN3.8)
NetCN4_2: Actuators (D8.3), Sockets (CN4.2)
NetCN4_3: Actuators (D18.3), Sockets (CN4.3)
NetCN4_5: RP2_pico (R13.2), Sockets (CN4.5)
NetCN4_6: RP2_pico (R5.2), Sockets (CN4.6)
NetCN4_9: RP2_pico (M2.8), Sockets (CN4.9)
NetCN4_10: RP2_pico (M2.9), Sockets (CN4.10)
NetCN4_13: Actuators (D9.3), Sockets (CN4.13)
NetCN4_15: RP2_pico (R11.2), Sockets (CN4.15)
NetCN4_20: Actuators (D15.3), Sockets (CN4.20)
NetM1_1: RP2_pico (M1.1), Sockets (R39.2)
NetM1_2: RP2_pico (M1.2), Sockets (R38.2)
NetM1_5: RP2_pico (M1.5), Actuators (R18.1 R47.1)
NetM1_6: RP2_pico (M1.6), Actuators (R26.1 R50.1)
NetM1_9: RP2_pico (M1.9), Power (R16.2 R53.1)
NetM1_10: RP2_pico (M1.10), Sockets (R40.2)
NetM1_21: RP2_pico (M1.21), Actuators (R23.2 R48.1)
NetM1_22: RP2_pico (M1.22), Actuators (R34.2 R52.1)
NetM1_24: RP2_pico (M1.24), Actuators (R32.2 R51.1)
NetM1_25: RP2_pico (M1.25), Actuators (R25.2 R49.1)
NetM1_26: RP2_pico (M1.26), Sockets (R43.2)
NetM1_27: RP2_pico (M1.27), Sockets (R44.2)
NetM1_29: RP2_pico (M1.29), Sockets (R45.2)
NetM1_34: RP2_pico (M1.34), Sockets (R46.2)
OW-Temp-sensors: RP2_pico (M1.4 R3.1), Sockets (R36.2)